# Altium schematic sheet IPM_Schematic.SchDoc
size 431 x 279 mm; SheetNumber: 1; SheetTotal: 1
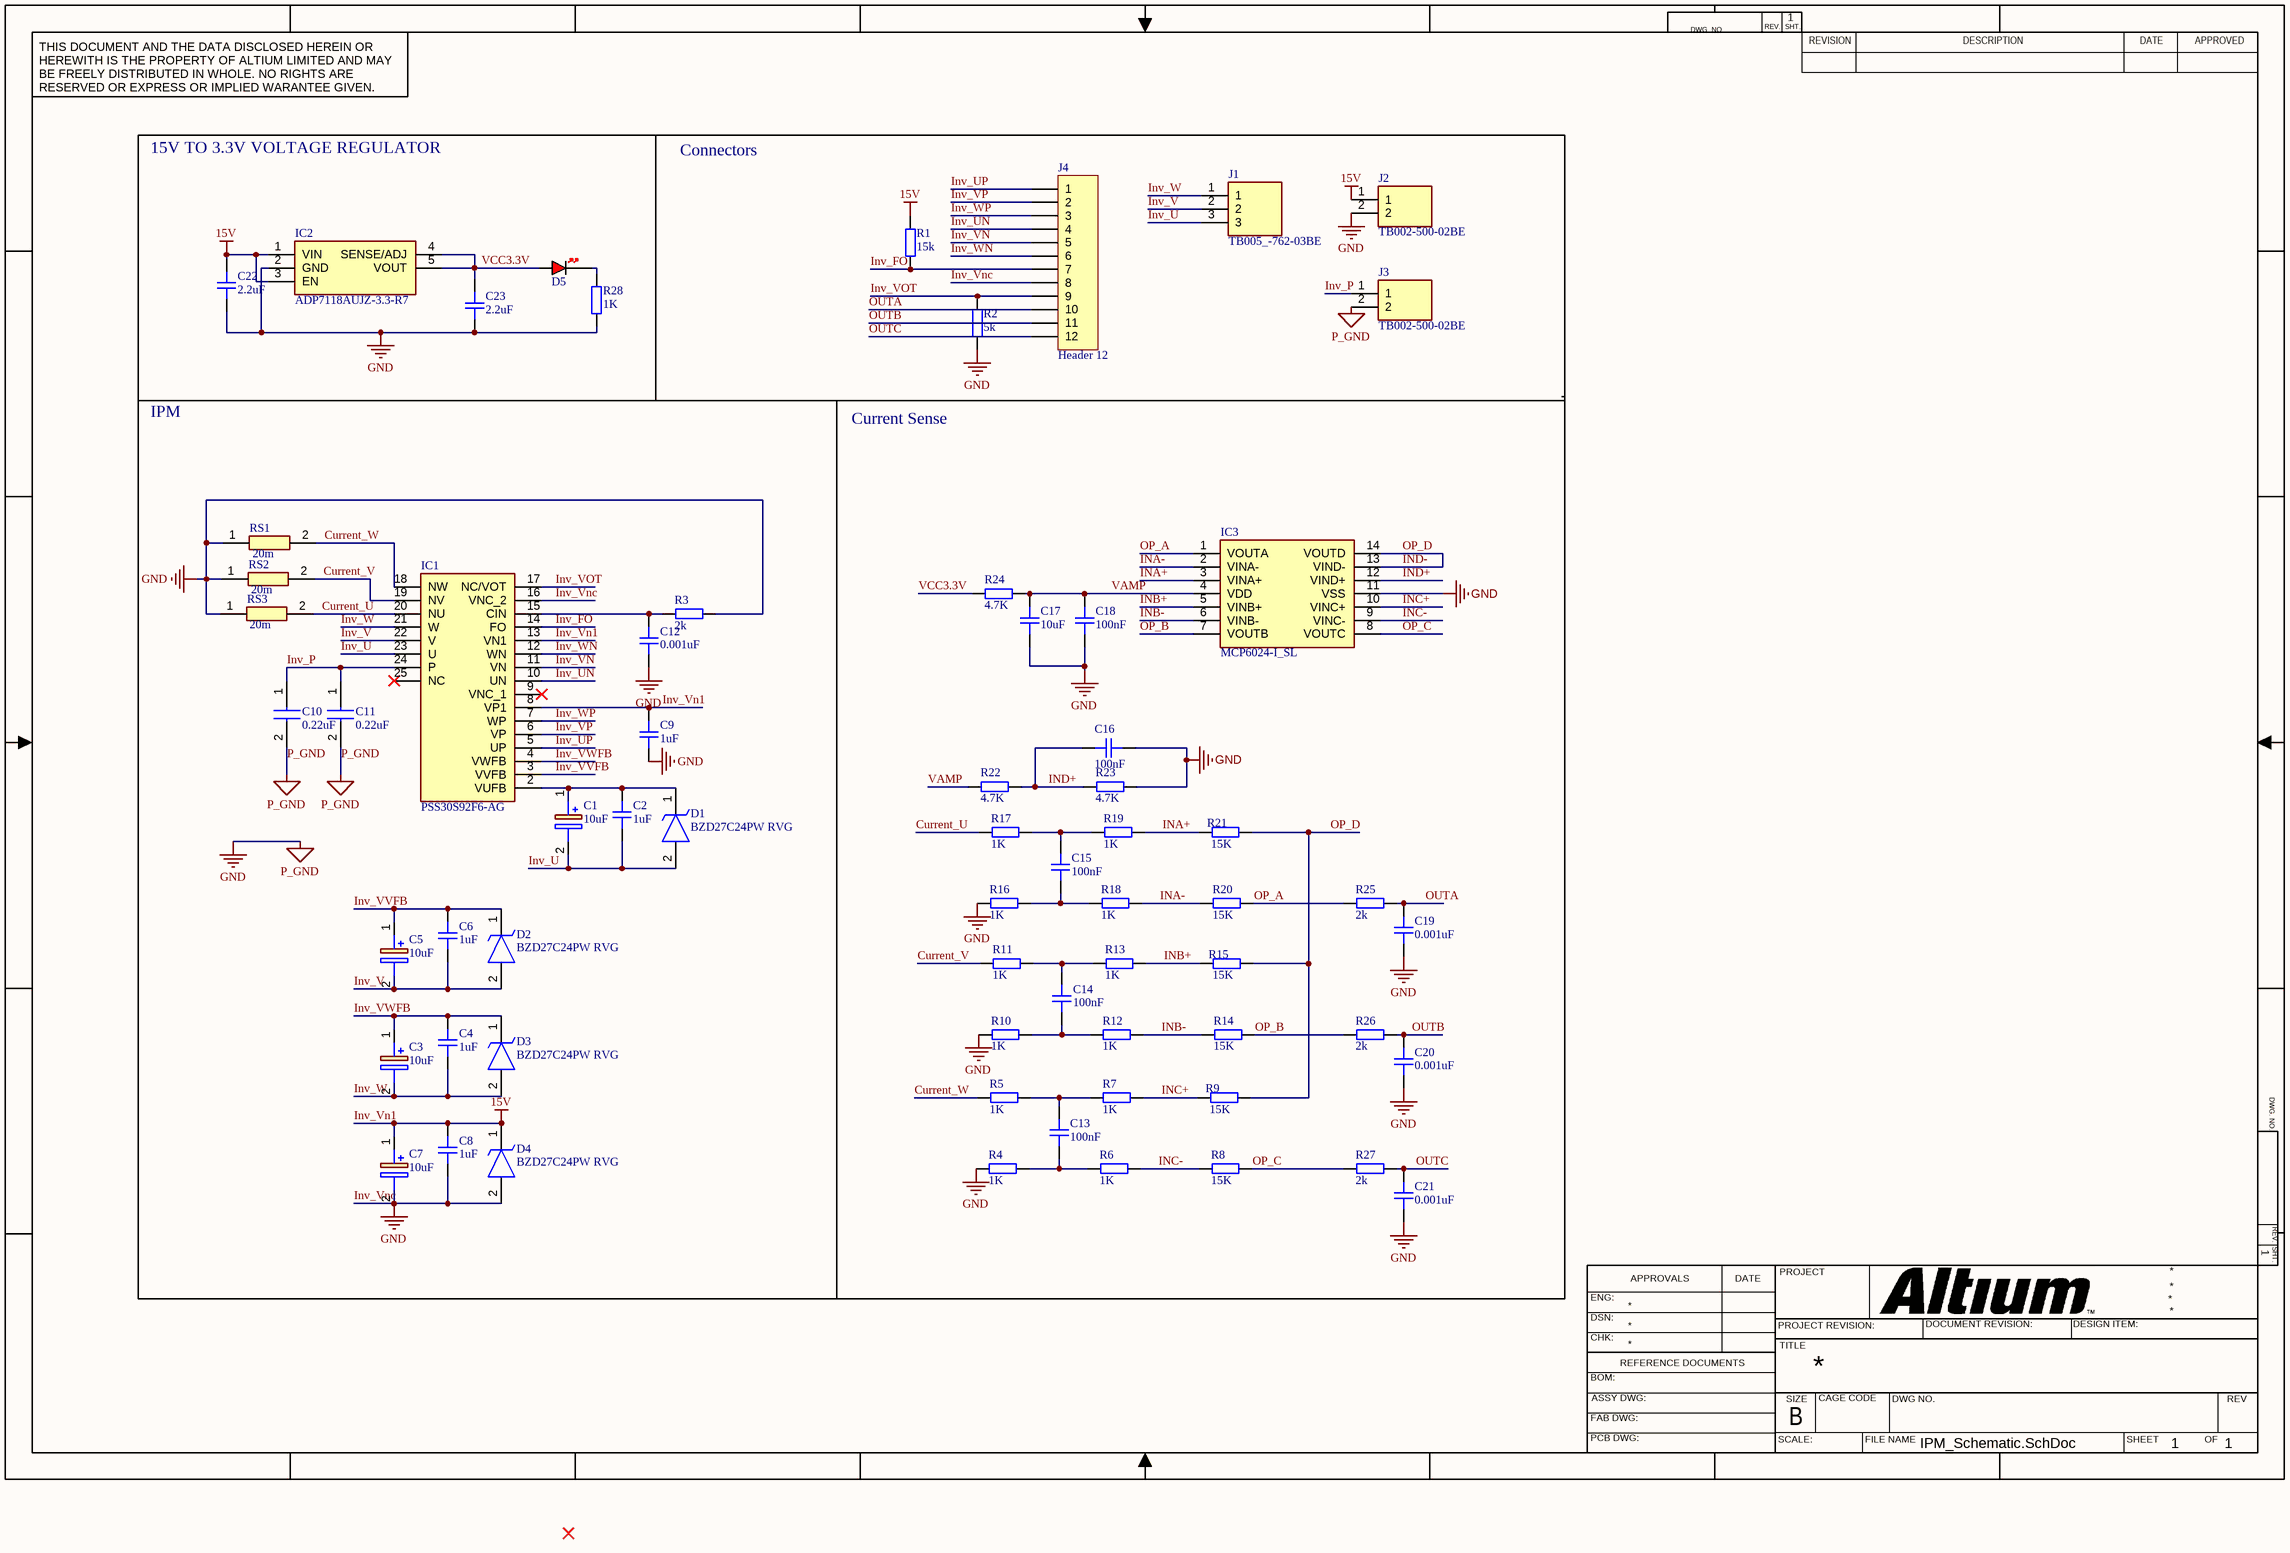
[diagram p0: IPM_Schematic.SchDoc]

## Parts
C1  10uF  [EEE1AA220WR]
C2  1uF  [CAP_1206]
C3  10uF  [EEE1AA220WR]
C4  1uF  [CAP_1206]
C5  10uF  [EEE1AA220WR]
C6  1uF  [CAP_1206]
C7  10uF  [EEE1AA220WR]
C8  1uF  [CAP_1206]
C9  1uF  [CAP_1206]
C10  0.22uF  [CAPC5750X450N]
C11  0.22uF  [CAPC5750X450N]
C12  0.001uF  [CAP_0805]
C13  100nF  [CAP_0603]
C14  100nF  [CAP_0603]
C15  100nF  [CAP_0603]
C16  100nF  [CAP_0603]
C17  10uF  [CAP_0603]
C18  100nF  [CAP_0603]
C19  0.001uF  [CAP_0805]
C20  0.001uF  [CAP_0805]
C21  0.001uF  [CAP_0805]
C22  2.2uF  [CAP_0603]
C23  2.2uF  [CAP_0603]
D1  BZD27C24PW RVG  [SODFL3718X140N]
D2  BZD27C24PW RVG  [SODFL3718X140N]
D3  BZD27C24PW RVG  [SODFL3718X140N]
D4  BZD27C24PW RVG  [SODFL3718X140N]
D5  RED  [LED_0402_RED]  (value not drawn)
IC1  PSS30S92F6-AG  [PSS30S92F6AG]
IC2  ADP7118AUJZ-3.3-R7  [SOT95P280X100-5N]
IC3  MCP6024-I_SL  [SOIC127P600X175-14N]
J1  TB005_-762-03BE  [CUI_TB005 -762-03BE]
J2  TB002-500-02BE  [TB00250002BE]
J3  TB002-500-02BE  [TB00250002BE]
J4  Header 12  [HDR1X12]
R1  15k  [RES_0603]
R2  5k  [RES_0603]
R3  2k  [RES_0805]
R4  1K  [RES_0603]
R5  1K  [RES_0603]
R6  1K  [RES_0603]
R7  1K  [RES_0603]
R8  15K  [RES_0603]
R9  15K  [RES_0603]
R10  1K  [RES_0603]
R11  1K  [RES_0603]
R12  1K  [RES_0603]
R13  1K  [RES_0603]
R14  15K  [RES_0603]
R15  15K  [RES_0603]
R16  1K  [RES_0603]
R17  1K  [RES_0603]
R18  1K  [RES_0603]
R19  1K  [RES_0603]
R20  15K  [RES_0603]
R21  15K  [RES_0603]
R22  4.7K  [RES_0603]
R23  4.7K  [RES_0603]
R24  4.7K  [RES_0603]
R25  2k  [RES_0805]
R26  2k  [RES_0805]
R27  2k  [RES_0805]
R28  1K  [RES_0402]
RS1  20m  [RESC6432X89N]
RS2  20m  [RESC6432X89N]
RS3  20m  [RESC6432X89N]

## Blocks framed on the sheet
15V TO 3.3V VOLTAGE REGULATOR: C22 C23 D5 IC2 R28

## Nets
Inv_Vn1: C7.1(+) C8.2 C9.2 C22.2 D4.1(K) IC1.8(VP1) IC1.13(VN1) IC2.1(VIN) IC2.3(EN) J2.1 R1.2  [also labelled 15V]
Inv_Vnc: C7.2(-) C8.1 C9.1 C10.2 C11.2 C12.2 C16.1 C17.2 C18.2 C19.2 C20.2 C21.2 C22.1 C23.1 D4.2(A) IC1.16(VNC_2) IC2.2(GND) IC3.11(VSS) J2.2 J3.2 J4.8 R2.1 R3.2 R4.1 R10.1 R16.1 R23.2 R28.1 RS1.1 RS2.1 RS3.1  [also labelled GND, P_GND]
Current_U: IC1.20(NU) R17.1 RS3.2
Current_V: IC1.19(NV) R11.1 RS2.2
Current_W: IC1.18(NW) R5.1 RS1.2
INA+: IC3.3(VINA+) R19.2 R21.1
INA-: IC3.2(VINA-) R18.2 R20.1
INB+: IC3.5(VINB+) R13.2 R15.1
INB-: IC3.6(VINB-) R12.2 R14.1
INC+: IC3.10(VINC+) R7.2 R9.1
INC-: IC3.9(VINC-) R6.2 R8.1
IND+: C16.2 IC3.12(VIND+) R22.2 R23.1
IND-: IC3.13(VIND-) IC3.14(VOUTD) R9.2 R15.2 R21.2  [also labelled OP_D]
Inv_FO: IC1.14(FO) J4.7 R1.1
Inv_P: C10.1 C11.1 IC1.24(P) J3.1
Inv_U: C1.2(-) C2.1 D1.2(A) IC1.23(U) J1.3
Inv_UN: IC1.10(UN) J4.4
Inv_UP: IC1.5(UP) J4.1
Inv_V: C5.2(-) C6.1 D2.2(A) IC1.22(V) J1.2
Inv_VN: IC1.11(VN) J4.5
Inv_VOT: IC1.17(NC/VOT) J4.9 R2.2
Inv_VP: IC1.6(VP) J4.2
Inv_VVFB: C5.1(+) C6.2 D2.1(K) IC1.3(VVFB)
Inv_VWFB: C3.1(+) C4.2 D3.1(K) IC1.4(VWFB)
Inv_W: C3.2(-) C4.1 D3.2(A) IC1.21(W) J1.1
Inv_WN: IC1.12(WN) J4.6
Inv_WP: IC1.7(WP) J4.3
OP_A: IC3.1(VOUTA) R20.2 R25.1
OP_B: IC3.7(VOUTB) R14.2 R26.1
OP_C: IC3.8(VOUTC) R8.2 R27.1
OUTA: C19.1 J4.10 R25.2
OUTB: C20.1 J4.11 R26.2
OUTC: C21.1 J4.12 R27.2
VAMP: C17.1 C18.1 IC3.4(VDD) R22.1 R24.2
VCC3.3V: C23.2 D5.A IC2.4(SENSE/ADJ) IC2.5(VOUT) R24.1
NetC1_1: C1.1(+) C2.2 D1.1(K) IC1.2(VUFB)
NetC12_1: C12.1 IC1.15(CIN) R3.1
NetC13_1: C13.1 R4.2 R6.1
NetC13_2: C13.2 R5.2 R7.1
NetC14_1: C14.1 R10.2 R12.1
NetC14_2: C14.2 R11.2 R13.1
NetC15_1: C15.1 R16.2 R18.1
NetC15_2: C15.2 R17.2 R19.1
NetD5_K: D5.K R28.2

Not connected (* = marked no-connect by the designer): IC1 9(VNC_1)* 25(NC)*

## Notes on the sheet
- Connectors
- IPM
- Current Sense
- DWG. NO.
- REV.
- SHT.
- THIS DOCUMENT AND THE DATA DISCLOSED HEREIN OR HEREWITH IS THE PROPERTY OF ALTIUM LIMITED AND MAY BE FREELY DISTRIBUTED IN WHOLE. NO RIGHTS ARE RESERVED OR EXPRESS OR IMPLIED WARANTEE GIVEN.
- REVISION
- DESCRIPTION
- DATE
- APPROVED
- ENG:
- APPROVALS
- PROJECT
- DSN:
- CHK:
- REFERENCE DOCUMENTS
- PROJECT REVISION:
- TITLE
- DOCUMENT REVISION:
- DESIGN ITEM:
- BOM:
- FAB DWG:
- PCB DWG:
- ASSY DWG:
- SCALE:
- SIZE
- B
- CAGE CODE
- FILE NAME
- DWG NO.
- SHEET
- OF
- REV

## Library data of the parts
C1 C3 C5 C7 = EEE-FTH100UAR: Capacitor Polarised; Manufacturer_Name: Panasonic; Datasheet Link: http://industrial.panasonic.com/cdbs/www-data/pdf/RDE0000/ABA0000C1240.pdf; Height: 5.5mm; Manufacturer_Part_Number: EEE-FTH100UAR; Mouser Part Number: 667-EEE-FTH100UAR; Mouser Price/Stock: https://www.mouser.co.uk/ProductDetail/Panasonic/EEE-FTH100UAR?qs=CMJjuEs1%252BuHShVFRjhUJug%3D%3D
C2 C4 C6 C8 C9 = CAP_1206_50V: Capacitor SMD 1206 50V
C10 C11 = 2220Y1K20224KXTWS3: Capacitor; Manufacturer_Name: Knowles; Datasheet Link: https://www.knowlescapacitors.com/getattachment/7b1f496b-1e36-4b78-bce7-3e8a26a0acf9/StackiCap; Height: 4.5mm; Manufacturer_Part_Number: 2220Y1K20224KXTWS3; Mouser Part Number: 843-2220Y1K20224KXTW; Mouser Price/Stock: https://www.mouser.co.uk/ProductDetail/Knowles-Syfer/2220Y1K20224KXTWS3?qs=vmHwEFxEFR%2Fbt5hDXBD89w%3D%3D
C12 C19-C21 = CAP_0805_25V: Capacitor SMD 0805 25V
C13-C18 C22 C23 = CAP_0603_50V: Capacitor SMD 0603 50V
D1-D4 = SJD12A28L01: TVS Diode (Uni-directional); Manufacturer_Name: YAGEO; Datasheet Link: https://www.mouser.de/datasheet/2/447/SJD12A_C_XXXL01_1-1954794.pdf; Height: 1.4mm; Manufacturer_Part_Number: SJD12A28L01; Mouser Part Number: 603-SJD12A28L01; Mouser Price/Stock: https://www.mouser.co.uk/ProductDetail/YAGEO/SJD12A28L01?qs=0lSvoLzn4L8OgNVKVrTbqg%3D%3D
D5 = LED_0402_RED: LED 0402 RED SMD
IC1 = PSS30S92F6-AG: Integrated Circuit; Manufacturer_Name: Mitsubishi; Datasheet Link: https://componentsearchengine.com/Datasheets/2/PSS30S92F6-AG.pdf; Height: 6mm; Manufacturer_Part_Number: PSS30S92F6-AG; Mouser Part Number: 917-PSS30S92F6-AG; Mouser Price/Stock: https://www.mouser.co.uk/ProductDetail/Mitsubishi-Electric/PSS30S92F6-AG?qs=GedFDFLaBXHAfjcyBhRgZQ%3D%3D
IC2 = ADP7118AUJZ-3.3-R7: Integrated Circuit; Manufacturer_Name: Analog Devices; Datasheet Link: https://www.analog.com/ADP7118/datasheet; Height: 1mm; Manufacturer_Part_Number: ADP7118AUJZ-3.3-R7; Mouser Part Number: 584-ADP7118AUJZ3.3R7; Mouser Price/Stock: https://www.mouser.co.uk/ProductDetail/Analog-Devices/ADP7118AUJZ-3.3-R7?qs=hpwIUhX6lWxSxNRE9lKdtQ%3D%3D; Arrow Part Number: ADP7118AUJZ-3.3-R7; Arrow Price/Stock: https://www.arrow.com/en/products/adp7118aujz-3.3-r7/analog-devices?region=nac
IC3 = MCP6024-I_SL: Integrated Circuit; Manufacturer_Name: Microchip; Manufacturer_Part_Number: MCP6024-I/SL; Datasheet Link: https://datasheet.datasheetarchive.com/originals/distributors/SFDatasheet-4/sf-00090088.pdf; Height: 1.75mm; Mouser Part Number: 579-MCP6024-I/SL; Mouser Price/Stock: https://www.mouser.co.uk/ProductDetail/Microchip-Technology/MCP6024-I-SL?qs=QQ%252Byn%2FmNCzxlSLtX4H41uA%3D%3D; Arrow Part Number: MCP6024-I/SL; Arrow Price/Stock: https://www.arrow.com/en/products/mcp6024-isl/microchip-technology?region=nac
J1 = TB005_-762-03BE: 3 Position Wire to Board Terminal Block Horizontal with Board 0.300 (7.62mm) Through Hole; MF: CUI; MP: TB005 -762-03BE; Value: *; Availability: In Stock; Price: None; SnapEDA_Link: https://www.snapeda.com/parts/TB005%20-762-03BE/CUI/view-part/?ref=snap; Check_prices: https://www.snapeda.com/parts/TB005%20-762-03BE/CUI/view-part/?ref=eda; Purchase-URL: https://pricing.snapeda.com/search/part/TB005 -762-03BE/?ref=eda; Package: None
J2 J3 = TB002-500-02BE: Connector; Manufacturer_Name: CUI Devices; Datasheet Link: https://eu.mouser.com/datasheet/2/670/tb002_500-1550579.pdf; Height: 10.4mm; Manufacturer_Part_Number: TB002-500-02BE; Mouser Part Number: 490-TB002-500-02BE; Mouser Price/Stock: https://www.mouser.co.uk/ProductDetail/CUI-Devices/TB002-500-02BE?qs=vLWxofP3U2x9716kcgva%2Fw%3D%3D; Arrow Part Number: TB002-500-02BE; Arrow Price/Stock: https://www.arrow.com/en/products/tb002-500-02be/cui-devices?region=nac
J4 = Header 12: Header, 12-Pin; LatestRevisionDate: 17-Jul-2002; LatestRevisionNote: Re-released for DXP Platform.; Publisher: Altium Limited
R1 R2 R4-R24 = RES_0603: Resistor SMD 0603
R3 R25-R27 = RES_0805: Resistor SMD 0805
R28 = RES_0402: Resistor SMD 0402
RS1-RS3 = PE2512FKE7W0R02L: Resistor; Manufacturer_Name: KEMET; Datasheet Link: https://www.mouser.com/datasheet/2/447/yageodocoutput-1518764.pdf; Height: 0.89mm; Manufacturer_Part_Number: PE2512FKE7W0R02L; Mouser Part Number: 603-PE2512FKE7W0R02L; Mouser Price/Stock: https://www.mouser.com/Search/Refine.aspx?Keyword=603-PE2512FKE7W0R02L; Arrow Part Number: PE2512FKE7W0R02L; Arrow Price/Stock: https://www.arrow.com/en/products/pe2512fke7w0r02l/yageo